# EAGLE design MP2456_EVM_V1-eagle_7.6 (EAGLE 7.7.0)

## Sheet 1 of 5
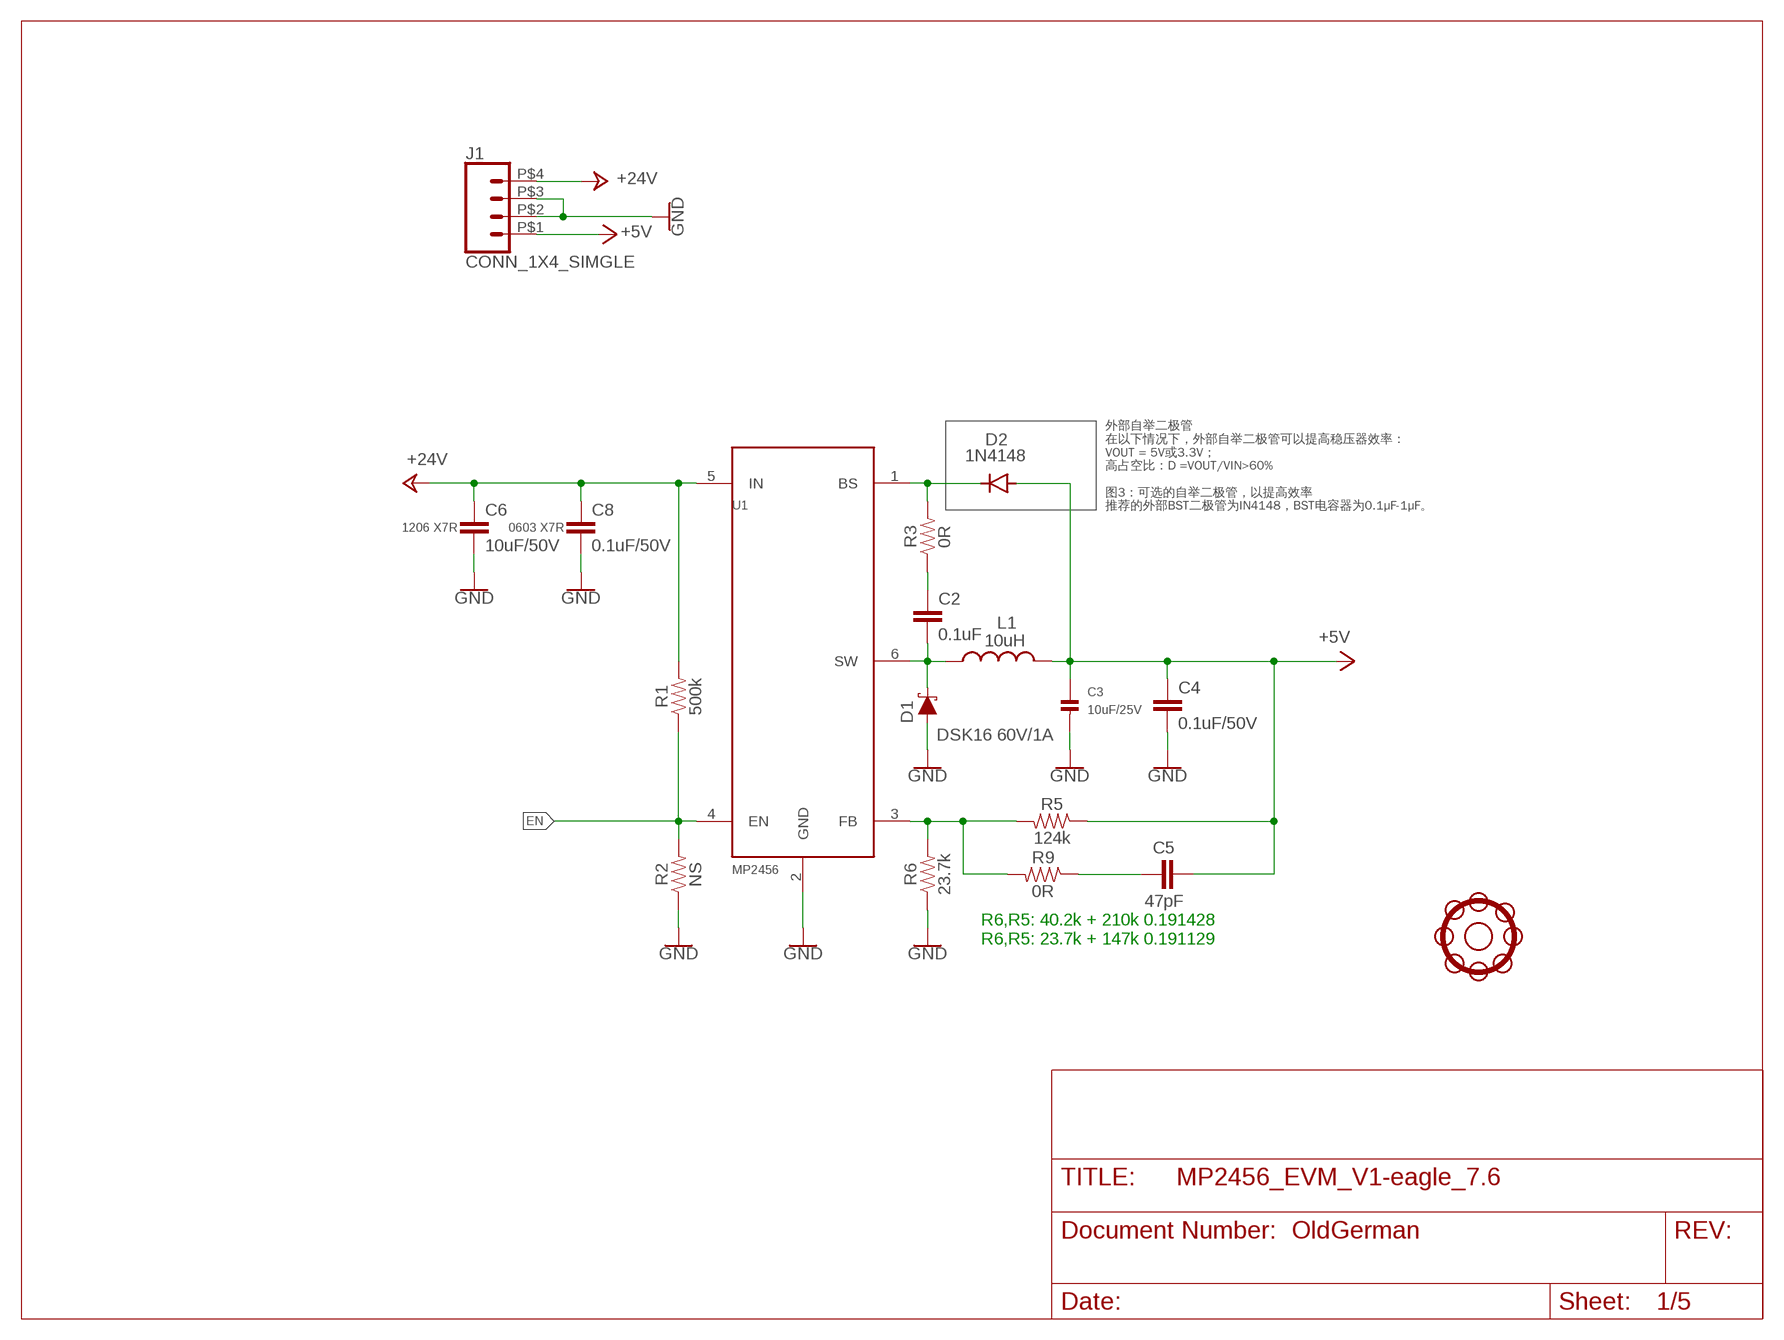
[diagram p0: schematic, sheet 1]

### Parts
C2  0.1uF  CAP-0603  [0603]
C3  10uF/25V  CAP_CERAMIC_0805MP  [_0805MP]
C4  0.1uF/50V  CAP-0603  [0603]
C5  47pF  CAP-0603  [0603]
C6  10uF/50V  CAP-1206  [1206]
C8  0.1uF/50V  CAP-0603  [0603]
D1  DSK16 60V/1A  B5819W-SOD123  [SOD123]
D2  1N4148  DIODE-SOD123  [SOD123]
J1  CONN_1X4_SIMGLE  [CONN_1X04_SINGLE]
L1  10uH  INDUCTOR_4040  [4020TYPE]
R1  500k  RESISTOR0603  [0603]
R2  NS  RESISTOR0603  [0603]
R3  0R  RESISTOR0603  [0603]
R5  124k  RESISTOR0603  [0603]
R6  23.7k  RESISTOR0603  [0603]
R9  0R  RESISTOR0603  [0603]
U1  MP2456  [SOT23-6]
U$1  SUN_HOLE_M3  [SUN_HOLE_M3]

### Nets
+5V: C3.1 C4.1 C5.2 D2.A J1.P$1 L1.P$2 R5.1
+24V: C6.1 C8.1 J1.P$4 R1.2 U1.5(IN)
BS: D2.C R3.2 U1.1(BS)
EN: R1.1 R2.2 U1.4(EN)
GND: C3.2 C4.2 C6.2 C8.2 D1.A J1.P$2 J1.P$3 R2.1 R6.1 U1.2(GND)
N$2: C2.1 R3.1
N$4: R5.2 R6.2 R9.2 U1.3(FB)
N$5: C5.1 R9.1
SW: C2.2 D1.C L1.P$1 U1.6(SW)

### Notes on the sheet
- 外部自举二极管
  在以下情况下，外部自举二极管可以提高稳压器效率：
  VOUT = 5V或3.3V； 
  高占空比：D =VOUT/VIN>60%
  
  图3：可选的自举二极管，以提高效率
  推荐的外部BST二极管为IN4148，BST电容器为0.1µF-1µF。
- 1206 X7R | 0603 X7R
- R6,R5: 40.2k + 210k 0.191428
  R6,R5: 23.7k + 147k 0.191129
- OldGerman

## Sheet 2 of 5

## Sheet 3 of 5

## Sheet 4 of 5

## Sheet 5 of 5

## Library data of the parts
C2 C4-C6 C8 = SparkFun-Capacitors:CAP
C3 = microbuilder:CAP_CERAMIC: Ceramic Capacitors 0402 - 0402 Surface Mount Capacitors 16pF 50V 5% [Digikey: 445-4899-2-ND] 18pF 50V 5% [Digikey: 490-1281-2-ND] 22pF 50V 5% [Digikey: 490-1283-2-ND] 68pF 50V 5% [Digikey: 490-1289-2-ND] 0.1uF 10V 10% [Digikey: 490-1318-2-ND] 1.0uF 6.3V 10% [Digikey: 490-1320-2-ND] 0603 - 0603 Surface Mount Capacitors 16 pF 50V 5% [Digikey: 445-5051-2-ND] 22 pF 50V [Digikey: PCC220ACVTR-ND] 33 pF 50V 5% [Digikey: 490-1415-1-ND] 56pF 50V 5% [Digikey: 490-1421-1-ND] 220pF 50V 5% [Digikey: 445-1285-1-ND] 680 pF 50V 2200 pF 50V 5% C0G [Digikey: 445-1297-1-ND] 5600 pF 100V 5% X7R [Digikey: 478-3711-1-ND] 0.1 µF 25V 10% [Digikey: PCC2277TR-ND] 0.22 µF 16V 10% X7R [Digikey: 445-1318-1-ND] 1.0 µF 25V 10% [Digikey: 445-5146-2-ND] 0603 - RF Specific 3pF 250V +/-0.1pF RF [Digikey: 712-1347-1-ND] 18 pF 250V 5% [Digikey: 478-3505-1-ND or 712-1322-1-ND] 56 pF 250V 5% C0G RF [Digikey: 490-4867-1-ND] 68 pF 250V RF [Digikey: 490-4868-1-ND] 0805 - 0805 Surface Mount Capacitors 220 pF 250V 2% RF Ceramic Capacitor [Digikey: 712-1398-1-ND] 1000 pF 50V 2% NP0 Ceramic Capacitor [Digikey: 478-3760-1-ND] 0.1 µF 25V 10% Ceramic Capacitor [Digikey: PCC1828TR-ND] 1.0 µF 16V 10% Ceramic Capacitor[Digikey: 490-1691-2-ND] 10.0 µF 10V 10% Ceramic Capacitor[Digikey: 709-1228-1-ND] 10.0 uF 16V 10% Ceramic Capacitor [Digikey: 478-5165-2-ND] 47 uF 6.3V 20% Ceramic Capacitor [Digikey: 587-1779-1-ND or 399-5506-1-ND] 1206 - 1206 Surface Mount Capacitors 47uF 10V 20% Ceramic Capacitor [Digikey: 490-5528-1-ND or 399-5508-1-ND or 445-6010-1-ND] 100uF 6.3V -20%, +80% Y5V Ceramic Capacitor (Digikey: 490-4512-1-ND, Mouser: 81-GRM31CF50J107ZE1L)
D1 = DIP:B5819W-SOD123
D2 = diode:DIODE-: DIODE
J1 = DIP:CONN_1X4_SIMGLE
L1 = DIP:INDUCTOR_4040
R1-R3 R5 R6 R9 = SparkFun-Resistors:RESISTOR: Generic Resistor Package
U1 = DIP:MP2456
U$1 = DIP:SUN_HOLE_M3

## Board
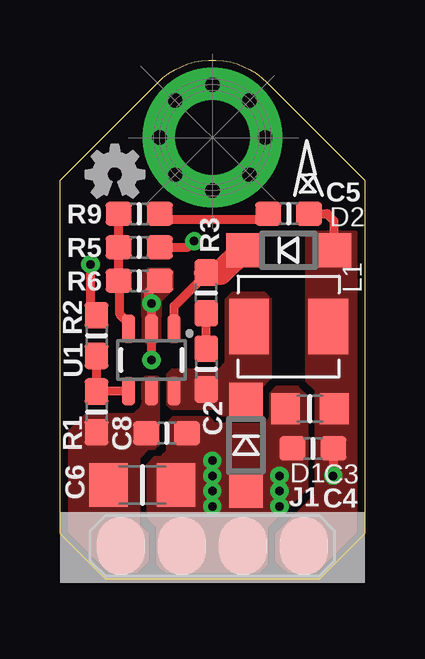
[diagram p1: board, top side]
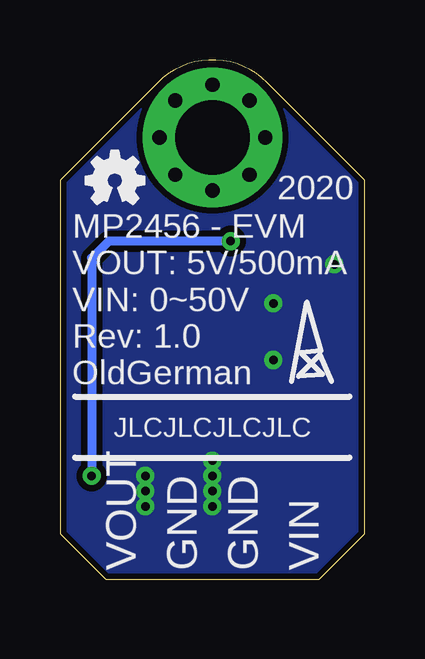
[diagram p2: board, bottom side, seen from below]

Size 12.7 x 21.64 mm. Coordinates in mm from the lower left corner, seen from the top.
Outline: 1.9,0 0,1.91 0,16.64 4.06,20.7 arc-90 8.64,20.7 12.7,16.64 12.7,1.91 10.79,0 1.9,0
Copper layers (1*16): Top 0.035mm / dielectric 1.5mm / Bottom 0.035mm
Design rules "default *": minimum track width 6mil, minimum drill 0.35mm, track to track 10mil, track to pad 10mil, pad to pad 10mil, via to via 10mil, smd to smd 10mil, copper to edge 10mil, drill to drill 6mil, minimum pad ring 10mil, minimum via ring 8mil, stop-mask expansion 1mil, vias tented up to drill 15mil, thermal gap 10mil

### Footprints (pad centres in the part's own frame; a part is rotated, then mirrored left to right if it is on the bottom)
0603 = smd 1.1 x 1: 1 -0.85,0; 2 0.85,0
_0805MP = smd 1.2 x 1.3: 1 -1.016,0; 2 1.016,0
1206 = smd 1.6 x 1.8: 1 -1.4,0; 2 1.4,0
SOD123 = smd 1.4 x 1.4: A 1.9,0; C -1.9,0
CONN_1X04_SINGLE = smd 2 x 2.4: P$1 -3.81,0; P$2 -1.27,0; P$3 1.27,0; P$4 3.81,0
4020TYPE = smd 1.65 x 2.3: P$1 -1.65,0; P$2 1.65,0
SOT23-6 = smd 0.55 x 1.2: 1 0.95,1.3; 2 0,1.3; 3 -0.95,1.3; 4 -0.95,-1.3; 5 0,-1.3; 6 0.95,-1.3
SUN_HOLE_M3 = drill 3.1 pad 5.8: P$1 0,0 | drill 0.6 pad 1: P$2 0,2.2; P$3 0,-2.2; P$4 -2.2,0; P$5 2.2,0; P$6 1.55,1.55; P$7 1.55,-1.55; P$8 -1.55,1.55; P$9 -1.55,-1.55

### Placement (x,y rotation side)
C2  6.1,8.76 270 top
C3  10.41,7.11 180 top
C4  10.54,5.46 180 top
C5  9.52,15.24 0 top
C6  3.43,3.94 0 top
C8  4.44,6.1 0 top
D1  7.75,5.59 270 top
D2  9.52,13.72 0 top
J1  6.35,1.4 180 top
L1  9.52,10.54 0 top
R1  1.52,6.99 270 top
R2  1.52,10.16 270 top
R3  6.1,11.94 90 top
R5  3.3,13.84 180 top
R6  3.3,12.45 180 top
R9  3.3,15.24 180 top
U1  3.81,9.14 0 top
U$1  6.35,18.41 0 top
U$3  [OSHW-LOGO-MINI]  10.41,16.64 0 bottom
U$4  [OSHW-LOGO-MINI]  2.29,16.89 0 top

### Tracks (layer width: path | path; a pad name or v marks a point on that pad's centre or on a via)
+5V  (via drill 0.35)
  Top 0.381: R5.1 5.33,13.84 v5.59,14.1 | D2.A 11.43,14.94 11.12,15.24 C5.2 | C4.1 11.39,4.33 v11.38,4.32
  Bottom 0.381: v5.59,14.1 10.67,14.1 11.38,13.39 v11.38,4.32
  pour Top (rank 2, no thermals): 9.02,0.76 9.02,1.91 10.67,3.56 10.67,7.87 10.29,8.26 10.29,14.48 12.32,14.48 12.32,1.52 10.79,0 9.78,0
+24V
  pour Top (no thermals): 0.38,1.52 1.9,0 2.92,0 3.68,0.76 3.68,1.91 3.3,2.29 3.3,5.08 3.68,5.46 3.94,5.46 4.11,5.64 4.11,8.38 4.06,8.43 3.56,8.43 3.33,8.2 3.33,7.11 3.07,6.86 1.07,6.86 0.38,6.17
BS
  Top 0.381: U1.1 4.76,11.39 6.1,12.72 R3.2
  Top 1.016: R3.2 6.11,12.78 6.68,12.78 D2.C
EN
  Top 0.381: U1.4 1.53,7.84 | R1.1 R2.2
  Top 0.508: 1.53,7.84 R1.1
GND  (via drill 0.35)
  Top 0.381: v1.27,13.13 1.27,11.26 R2.1 | R6.1 3.68,11.98 3.68,11.63 v3.81,11.51 U1.2 v3.81,9.14
  other vias: 6.35,4.95 6.35,4.32 6.35,3.68 6.35,3.05 9.14,4.32 9.14,3.68 9.14,3.05
  pour Top (rank 3, no thermals): 4.7,0 8,0 8.76,0.76 8.76,2.03 10.41,3.68 10.41,8 9.02,8 8.76,7.75 8.76,6.73 8.51,6.48 6.48,6.48 6.22,6.73 4.7,6.73 4.44,6.48 4.44,5.59 4.06,5.21 3.81,5.21 3.56,4.95 3.56,2.41 3.94,2.03 3.94,0.76
  pour Bottom (no thermals): -0.13,0 12.83,0 12.83,21.84 -0.13,21.84
  pour Top (no thermals): 3.68,9.78 3.43,10.03 3.43,12.7 3.68,12.95 4.57,12.95 4.7,12.83 4.7,12.09 4.19,11.58 4.19,10.03 3.94,9.78
N$2
  Top 0.381: C2.1 R3.1
N$4
  Top 0.381: U1.3 2.86,10.7 2.48,11.08 2.48,12.42 R6.2 R5.2 R9.2
N$5
  Top 0.381: C5.1 8.42,14.99 4.41,14.99 R9.1
SW
  pour Top (rank 4, no thermals): 4.5,7.29 4.5,8.56 4.67,8.74 6.63,8.74 6.93,9.04 6.93,11.68 7.19,11.94 8.51,11.94 8.76,11.68 8.76,6.99 8.51,6.73 6.6,6.73 6.35,6.99 4.8,6.99

### Text on the board
bPlace: 2020 | MP2456 - EVM / VOUT: 5V/500mA / VIN: 0~50V / Rev: 1.0 / OldGerman | JLCJLCJLCJLC | VIN | GND | GND | VOUT
tNames: L1